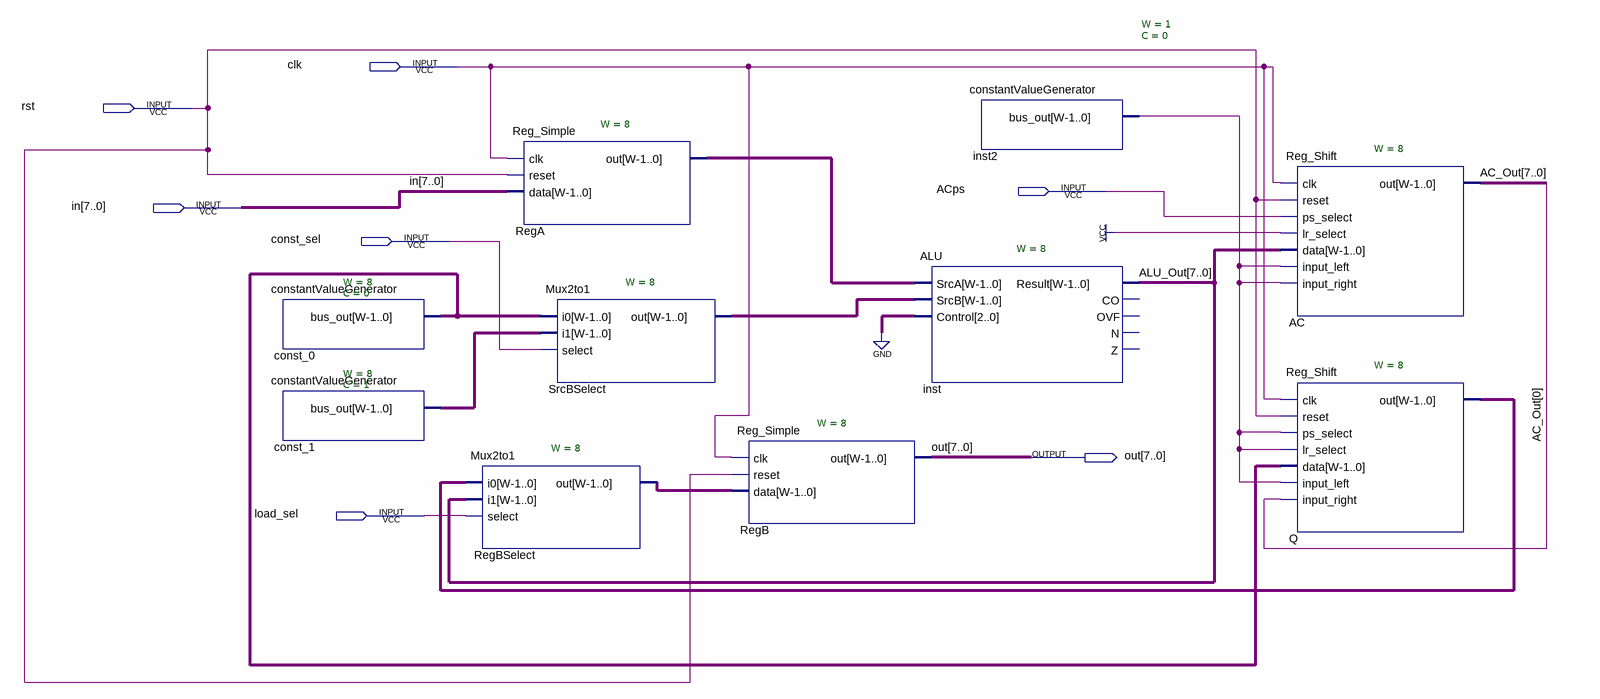
[diagram p0: schematic sheet]
// Quartus schematic lab1_datapath.bdf as structural Verilog: 10 symbols, 7 pins
module lab1_datapath (
  input  clk,
  input  rst,
  input  ACps,
  input  [7:0] in,
  input  const_sel,
  input  load_sel,
  output [7:0] out
);

  wire inst2_bus_out;
  wire [7:0] AC_Out, ALU_Out, const_0_bus_out, const_1_bus_out, Q_out, RegA_out, RegBSelect_out,
       SrcBSelect_out;

  constantValueGenerator #(.W(8), .C(0)) const_0 (.bus_out(const_0_bus_out));
  constantValueGenerator #(.W(8), .C(1)) const_1 (.bus_out(const_1_bus_out));
  Mux2to1 #(.W(8)) RegBSelect (.i0(Q_out), .i1(ALU_Out), .select(load_sel), .out(RegBSelect_out));
  Reg_Simple #(.W(8)) RegA (.clk(clk), .reset(rst), .data(in), .out(RegA_out));
  Mux2to1 #(.W(8)) SrcBSelect (.i0(const_0_bus_out), .i1(const_1_bus_out), .select(const_sel), .out(SrcBSelect_out));
  Reg_Simple #(.W(8)) RegB (.clk(clk), .reset(rst), .data(RegBSelect_out), .out(out));
  constantValueGenerator #(.W(1), .C(0)) inst2 (.bus_out(inst2_bus_out));
  ALU #(.W(8)) inst (
    .SrcA(RegA_out), .SrcB(SrcBSelect_out), .Control(3'b000), .Result(ALU_Out));  // open: CO, OVF, N, Z
  Reg_Shift #(.W(8)) AC (
    .clk(clk), .reset(rst), .ps_select(ACps), .lr_select(1'b1), .data(ALU_Out), .input_left(inst2_bus_out),
    .input_right(inst2_bus_out), .out(AC_Out));
  Reg_Shift #(.W(8)) Q (
    .clk(clk), .reset(rst), .ps_select(inst2_bus_out), .lr_select(inst2_bus_out), .data(const_0_bus_out),
    .input_left(inst2_bus_out), .input_right(AC_Out[0]), .out(Q_out));
endmodule
